# Altium project LightLink_V3.PrjPcb (part 2 of 2)

## Sheet CAN_SW.SchDoc
size A; SheetNumber: 6; SheetTotal: 6
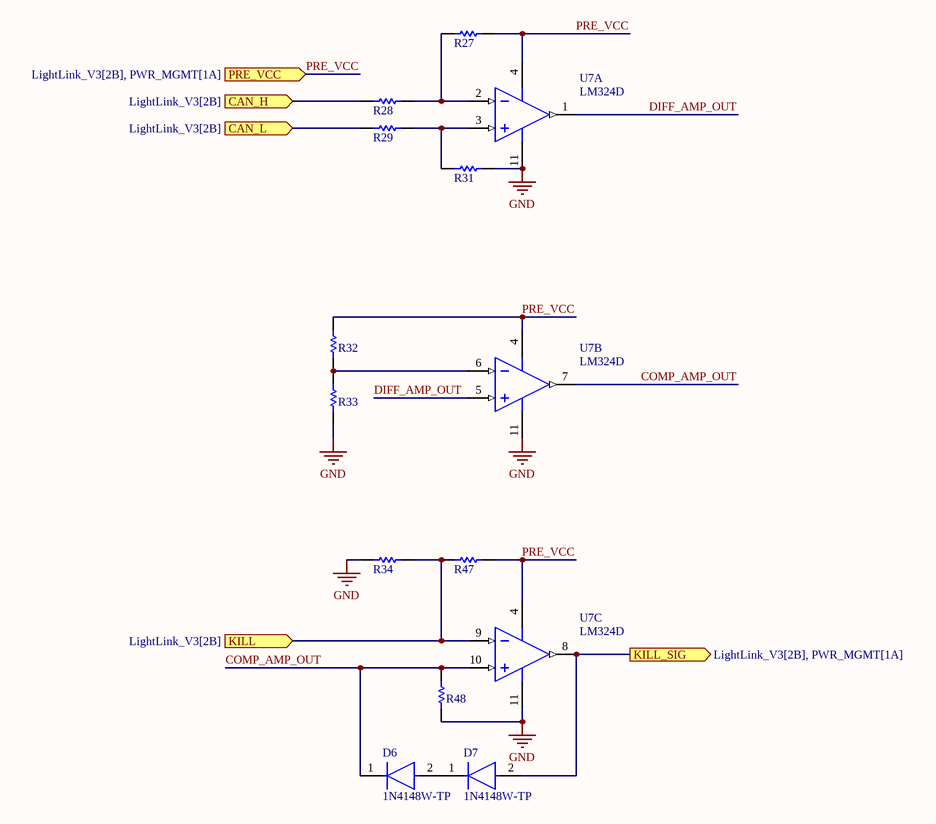
[diagram p5: CAN_SW.SchDoc]

### Parts
(Parts that share a designator on the sheet are numbered #1, #2 ... from top to bottom, then left to right.)
D6  1N4148W-TP  [FP-SOD-123-IPC_A]
D7  1N4148W-TP  [FP-SOD-123-IPC_A]
R27#2  ERJ3EKF1002V  [RESC1609X55X30LL15T15]  (value not drawn)
R28#2  ERJ3EKF1002V  [RESC1609X55X30LL15T15]  (value not drawn)
R29#2  ERJ3EKF1002V  [RESC1609X55X30LL15T15]  (value not drawn)
R31  ERJ3EKF1002V  [RESC1609X55X30LL15T15]  (value not drawn)
R32#2  ERJ3EKF1002V  [RESC1609X55X30LL15T15]  (value not drawn)
R33#2  ERJ-3EKF1001V  [RESC1608X55X30LL15T15]  (value not drawn)
R34#2  ERJ3EKF1002V  [RESC1609X55X30LL15T15]  (value not drawn)
R47  ERJ3EKF1002V  [RESC1609X55X30LL15T15]  (value not drawn)
R48  ERJ3EKF1002V  [RESC1609X55X30LL15T15]  (value not drawn)
U7#2  LM324D  [D0014A_L]  (parts A,B,C of 4)

### Ports
CAN_H (in, see LightLink_V3[2B]), CAN_L (in, see LightLink_V3[2B]), KILL (in, see LightLink_V3[2B]), KILL_SIG (out, see LightLink_V3[2B], PWR_MGMT[1A]), PRE_VCC (in, see LightLink_V3[2B], PWR_MGMT[1A])

### Nets
GND: R31.2 R33#2.1 R34#2.2 R48.1 U7#2.11(GND)
CAN_N: R29#2.1 ; port CAN_L
CAN_P: R28#2.1 ; port CAN_H
COMP_AMP_OUT: D6.1(C) R48.2 U7#2.7(2OUT) U7#2.10(3IN+)
D32: R34#2.1 R47.2 U7#2.9(3IN-) ; port KILL
DIFF_AMP_OUT: U7#2.1(1OUT) U7#2.5(2IN+)
KILL_SIG: D7.2(A) U7#2.8(3OUT) ; port KILL_SIG
PRE_VCC: R27#2.2 R32#2.2 R47.1 U7#2.4(VCC) ; port PRE_VCC
NetD6_2: D6.2(A) D7.1(C)
NetR27#2_1: R27#2.1 R28#2.2 U7#2.2(1IN-)
NetR29#2_2: R29#2.2 R31.1 U7#2.3(1IN+)
NetR32#2_1: R32#2.1 R33#2.2 U7#2.6(2IN-)

### Library data of the parts
D6 D7 = CMP-2000-04993-2: DIODE GEN PURP 100V 150MA SOD123; Max Reverse Leakage Current: 5uA; Max Surge Current: 2A; Reverse Recovery Time: 4ns; Polarity: Standard; Capacitance: 4pF; Max Forward Surge Current (Ifsm): 1A; Element Configuration: Single; Power Dissipation: 400mW; Forward Voltage: 1V; Radiation Hardening: No; Lead Free: Lead Free; Max Reverse Voltage (DC): 100V; Current Rating: 150mA; Forward Current: 150mA; Packaging: Tape and Reel; Number of Pins: 2; Package Quantity: 3000; Max Operating Temperature: 150°C; Min Operating Temperature: -65°C; Average Rectified Current: 150mA; Recovery Time: 4ns; Output Current: 150mA; Peak Non-Repetitive Surge Current: 2A; Width: 1.8mm; Voltage Rating (DC): 100V; Height: 1.2mm; Max Repetitive Reverse Voltage (Vrrm): 100V; Mount: Surface Mount; Length: 2.85mm
R27#2 R28#2 R29#2 R31 R32#2 R34#2 R47 R48 = CMP-1012-00623-3: Chip Resistor, 10 KOhm, +/- 1%, 0.1 W, -55 to 155 degC, 0603 (1608 Metric), RoHS, Tape and Reel; Manufacturer: Panasonic; Voltage Rating: 75V; Case\/Package: 0603; Power Rating: 100mW; Resistance: 10KOhm; Temperature Coefficient: 100ppm\/degreesC; Number of Pins: 2; Package Reference: 603; Depth: 0.8mm; Mount: SurfaceMount; Package Description: 2-Pin Surface Mount Device, Body 1.6 x 0.85 mm; Datasheet Version: 02/2017; Length: 1.6mm; Lead Free: LeadFree; Height: 0.45mm; Number of Terminations: 2; Max Power Dissipation: 100mW; Min Operating Temperature: -55degC; Datasheet URL: https://industrial.panasonic.com/cdbs/www-data/pdf/RDA0000/AOA0000C304.pdf; Termination: SMD/SMT; Case Code (Metric): 1608; Case Code (Imperial): 0603; Tolerance: 1%; Max Operating Temperature: 155degC; RoHSCompliant: true; Voltage Rating (DC): 75V; Radiation Hardening: No; Packaging: TapeandReel; Composition: ThickFilm; Mounting Technology: SurfaceMount; Manufacturer URL: http://www.panasonic.com/; Width: 0.031inch; REACH SVHC: NoSVHC; Contact Plating: Tin; Military Standard: Not; Package Quantity: 1
R33#2 = CMP-2000-00180-1: Manufacturer: Panasonic; Part Number: ERJ-3EKF1001V
U7#2 = CMP-2000-06547-1: Quadruple Operational Amplifier, 0.5 V/us, 1.2 MHz, 3 to 32 V, 0 to 70 degC, 14-Pin SOIC (D), Green (RoHS & no Sb/Br), Tube; Manufacturer: Texas Instruments; Unity Gain Bandwidth Product: 1.2MHz; Input Offset Voltage: 7mV; Dual Supply Voltage (Max): ±16V; Single Supply Voltage (Min): 3V; Single Supply Voltage (Max): 32V; Voltage Gain in dB: 100dB; Power Supply Requirement: Single/Dual; Input Bias Current: 250nA; Dual Supply Voltage (Min): ±1.5V; Single Supply Voltage (Typ): 5/9/12/15/18/24/28V; Dual Supply Voltage (Typ): ±3/±5/±9/±12/±15V; Number of  Elements: 4; Common Mode Rejection Ratio: 65dB; Datasheet Version: Rev. W, 03/2015; Technology: Bipolar; Shut Down Feature: No; Package Reference: D0014A; Type: GeneralPurposeAmplifier; Pin Count: 14; Package Type: SOIC; Rail/Rail I/O Type: No; Manufacturer URL: http://www.ti.com/; Package Description: 14-Pin Small Outline Integrated Circuit, Body 8.65 x 3.9 mm, Pitch 1.27 mm; Operating Temperature Classification: Commercial; Datasheet URL: http://www.ti.com/lit/ds/symlink/lm324.pdf; Slew Rate: 0.5V/us; Package URL: http://www.ti.com/lit/ml/mpds177g/mpds177g.pdf; Mounting: SurfaceMount; Packaging: Rail/Tube; Mounting Technology: SurfaceMount; Operating Temp Range: 0Cto70C

## Nets that join several sheets
+12: LightLink_V3 (6 pins), PWR_MGMT (Q14.5-6-7-8 Q16.5-6-7-8 R42.1)
GND: LightLink_V3 (32 pins), M (12 pins), M (12 pins), M (12 pins), M (12 pins), M (12 pins), M (12 pins), M (12 pins), M (12 pins), M (12 pins), M (12 pins), M (12 pins), M (12 pins), CAN (20 pins), PWR_MGMT (11 pins), INTERNAL_REGULATORS (14 pins), CAN_SW (5 pins)
VCC: M (9 pins), M (9 pins), M (9 pins), M (9 pins), M (9 pins), M (9 pins), M (9 pins), M (9 pins), M (9 pins), M (9 pins), M (9 pins), M (9 pins), PWR_MGMT (Q6.5-6-7-8 Q9.5-6-7-8 R24.1), INTERNAL_REGULATORS (6 pins)
5V_1: LightLink_V3 (J2.01 J6.3 J6.4 R12.2), CAN (6 pins)
5V_2: LightLink_V3 (J3.01 J8.3 J8.4 R11.2), CAN (6 pins)
12V_IN: LightLink_V3 (J15.1 J15.3), PWR_MGMT (F2.1)
A0: LightLink_V3 (J7.10 J9.10), M (R53_M#12.1 R54_M#12.2)
A1: LightLink_V3 (J7.9 J9.9), M (R53_M#1.1 R54_M#1.2)
A2: LightLink_V3 (J7.12 J9.12), M (R53_M#11.1 R54_M#11.2)
A3: LightLink_V3 (J7.11 J9.11), M (R53_M#2.1 R54_M#2.2)
A4: LightLink_V3 (J7.14 J9.14), M (R53_M#10.1 R54_M#10.2)
A5: LightLink_V3 (J7.13 J9.13), M (R53_M#3.1 R54_M#3.2)
A6: LightLink_V3 (J7.16 J9.16), M (R53_M#9.1 R54_M#9.2)
A7: LightLink_V3 (J7.15 J9.15), M (R53_M#4.1 R54_M#4.2)
A8: LightLink_V3 (J7.18 J9.18), M (R53_M#8.1 R54_M#8.2)
A9: LightLink_V3 (J7.17 J9.17), M (R53_M#5.1 R54_M#5.2)
A10: LightLink_V3 (J7.20 J9.20), M (R53_M#7.1 R54_M#7.2)
A11: LightLink_V3 (J7.19 J9.19), M (R53_M#6.1 R54_M#6.2)
A12: LightLink_V3 (J7.22 J9.22), PWR_MGMT (R42.2 R45.2)
A13: LightLink_V3 (J7.21 J9.21), PWR_MGMT (R41.2 R44.2)
A14: LightLink_V3 (J7.24 J9.24), PWR_MGMT (R23.2 R25.2)
A15: LightLink_V3 (J7.23 J9.23), PWR_MGMT (R24.2 R26.2)
CAN_N: LightLink_V3 (J14.2), CAN (R19.1 U3.6 U4.6), CAN_SW (R29#2.1)
CAN_P: LightLink_V3 (J14.1), CAN (R19.2 U3.7 U4.7), CAN_SW (R28#2.1)
CS_1: LightLink_V3 (J7.36), CAN (U2.16)
CS_2: LightLink_V3 (J9.36), CAN (U5.16)
D3: LightLink_V3 (J6.11 J8.11), M (R51_M#10.1 R52_M#10.2)
D4: LightLink_V3 (J6.14 J8.14), M (R9_M#10.1 R10_M#10.2)
D5: LightLink_V3 (J6.13 J8.13), M (R51_M#9.1 R52_M#9.2)
D6: LightLink_V3 (J6.16 J8.16), M (R9_M#9.1 R10_M#9.2)
D7: LightLink_V3 (J6.15 J8.15), M (R51_M#8.1 R52_M#8.2)
D8: LightLink_V3 (J6.18 J8.18), M (R9_M#8.1 R10_M#8.2)
D9: LightLink_V3 (J6.17 J8.17), M (R51_M#7.1 R52_M#7.2)
D10: LightLink_V3 (J6.20 J8.20), M (R9_M#7.1 R10_M#7.2)
D11: LightLink_V3 (J6.19 J8.19), M (R51_M#6.1 R52_M#6.2)
D12: LightLink_V3 (J6.22 J8.22), M (R38_M#9.1 R61_M#9.1)
D13: LightLink_V3 (J6.21 J8.21), M (R9_M#6.1 R10_M#6.2)
D14: LightLink_V3 (J6.24 J8.24), M (R51_M#5.1 R52_M#5.2)
D15: LightLink_V3 (J6.23 J8.23), M (R9_M#5.1 R10_M#5.2)
D16: LightLink_V3 (J6.26 J8.26), M (R51_M#4.1 R52_M#4.2)
D17: LightLink_V3 (J6.25 J8.25), M (R9_M#4.1 R10_M#4.2)
D18: LightLink_V3 (J6.28 J8.28), M (R51_M#3.1 R52_M#3.2)
D19: LightLink_V3 (J6.27 J8.27), M (R9_M#3.1 R10_M#3.2)
D20: LightLink_V3 (J6.30 J8.30), M (R51_M#2.1 R52_M#2.2)
D21: LightLink_V3 (J6.29 J8.29), M (R9_M#2.1 R10_M#2.2)
D22: LightLink_V3 (J6.32 J8.32), M (R51_M#1.1 R52_M#1.2)
D23: LightLink_V3 (J6.31 J8.31), M (R9_M#1.1 R10_M#1.2)
D24: LightLink_V3 (J6.34 J8.34), M (R38_M#8.1 R61_M#8.1)
D25: LightLink_V3 (J6.33 J8.33), M (R38_M#5.1 R61_M#5.1)
D26: LightLink_V3 (J6.36 J8.36), M (R38_M#7.1 R61_M#7.1)
D27: LightLink_V3 (J6.35 J8.35), M (R38_M#6.1 R61_M#6.1)
D28: LightLink_V3 (J6.38 J8.38), M (R38_M#4.1 R61_M#4.1)
D29: LightLink_V3 (J6.37 J8.37), M (R38_M#1.1 R61_M#1.1)
D30: LightLink_V3 (J6.40 J8.40), M (R38_M#3.1 R61_M#3.1)
D31: LightLink_V3 (J6.39 J8.39), M (R38_M#2.1 R61_M#2.1)
D32: LightLink_V3 (J7.26 J9.26), CAN_SW (R34#2.1 R47.2 U7#2.9)
D38: LightLink_V3 (J7.32 J9.32), M (R51_M#12.1 R52_M#12.2)
D40: LightLink_V3 (J7.34 J9.34), M (R9_M#12.1 R10_M#12.2)
D41: LightLink_V3 (J7.33 J9.33), M (R51_M#11.1 R52_M#11.2)
D43: LightLink_V3 (J7.35 J9.35), M (R9_M#11.1 R10_M#11.2)
D44: LightLink_V3 (J7.38 J9.38), M (R38_M#12.1 R61_M#12.1)
D45: LightLink_V3 (J7.37 J9.37), M (R38_M#10.1 R61_M#10.1)
D46: LightLink_V3 (J7.40 J9.40), M (R38_M#11.1 R61_M#11.1)
KILL_SIG: PWR_MGMT (R35.1 R39.1 R43.1), CAN_SW (D7.2 U7#2.8)
MISO_1: LightLink_V3 (J2.02), CAN (U2.15)
MISO_2: LightLink_V3 (J3.02), CAN (U5.15)
MOSI_1: LightLink_V3 (J2.03), CAN (U2.14)
MOSI_2: LightLink_V3 (J3.03), CAN (U5.14)
OUT_1: LightLink_V3 (J4.8), M (R2_M#1.2 R6_M#1.2)
OUT_2: LightLink_V3 (J4.7), M (R2_M#2.2 R6_M#2.2)
OUT_3: LightLink_V3 (J4.6), M (R2_M#3.2 R6_M#3.2)
OUT_4: LightLink_V3 (J4.5), M (R2_M#4.2 R6_M#4.2)
OUT_5: LightLink_V3 (J11.8), M (R2_M#5.2 R6_M#5.2)
OUT_6: LightLink_V3 (J11.7), M (R2_M#6.2 R6_M#6.2)
OUT_7: LightLink_V3 (J11.6), M (R2_M#7.2 R6_M#7.2)
OUT_8: LightLink_V3 (J11.5), M (R2_M#8.2 R6_M#8.2)
OUT_9: LightLink_V3 (J13.8), M (R2_M#9.2 R6_M#9.2)
OUT_10: LightLink_V3 (J13.7), M (R2_M#10.2 R6_M#10.2)
OUT_11: LightLink_V3 (J13.6), M (R2_M#11.2 R6_M#11.2)
OUT_12: LightLink_V3 (J13.5), M (R2_M#12.2 R6_M#12.2)
PRE_VCC: PWR_MGMT (11 pins), CAN_SW (R27#2.2 R32#2.2 R47.1 U7#2.4)
PWR_IN: LightLink_V3 (J1.1 J1.2 J1.5 J1.6), PWR_MGMT (F1.1)
SCK_1: LightLink_V3 (J2.04), CAN (U2.13)
SCK_2: LightLink_V3 (J3.04), CAN (U5.13)